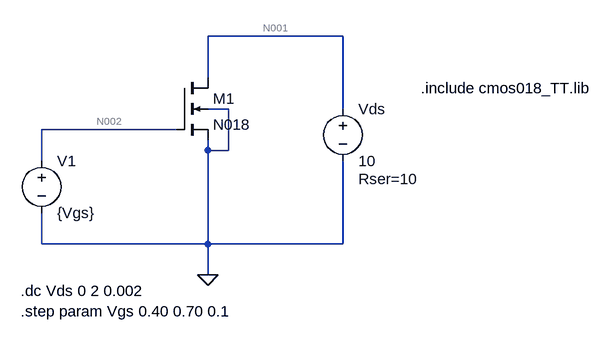
[diagram p0: schematic N018_Char.asc]
N018_Char.asc, the LTspice schematic file:
Version 4
SHEET 1 880 680
WIRE 416 96 208 96
WIRE 208 160 208 96
WIRE 240 208 208 208
WIRE 416 208 416 96
WIRE 160 240 -48 240
WIRE 208 272 208 256
WIRE 240 272 240 208
WIRE 240 272 208 272
WIRE -48 288 -48 240
WIRE -48 416 -48 368
WIRE 208 416 208 272
WIRE 208 416 -48 416
WIRE 416 416 416 288
WIRE 416 416 208 416
WIRE 208 464 208 416
FLAG 208 464 0
SYMBOL voltage -48 272 R0
WINDOW 123 0 0 Left 0
WINDOW 39 0 0 Left 0
SYMATTR InstName V1
SYMATTR Value {Vgs}
SYMBOL voltage 416 192 R0
WINDOW 123 0 0 Left 0
WINDOW 39 24 124 Left 2
SYMATTR SpiceLine Rser=10
SYMATTR InstName Vds
SYMATTR Value 10
SYMBOL nmos4 160 160 R0
SYMATTR InstName M1
SYMATTR Value N018
SYMATTR Value2 l=0.5u w=10u
TEXT 536 176 Left 2 !.include cmos018_TT.lib
TEXT -80 488 Left 2 !.dc Vds 0 2 0.002
TEXT -80 520 Left 2 !.step param Vgs 0.40 0.70 0.1

The netlist it stands for:
* N018_Char.asc
V1 N002 0 {Vgs}
Vds N001 0 10 Rser=10
M1 N001 N002 0 0 N018 l=0.5u w=10u
.model NMOS NMOS
.model PMOS PMOS
.lib standard.mos
.include cmos018_TT.lib
.dc Vds 0 2 0.002
.step param Vgs 0.40 0.70 0.1
.backanno
.end

* Results of the author's LTspice run, read from the files saved beside the schematic
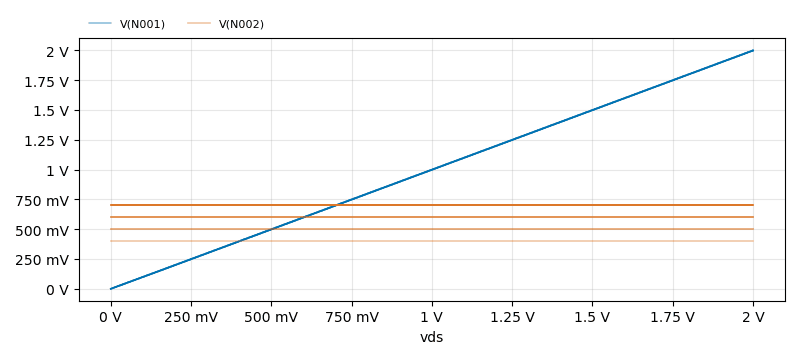
[diagram p1: DC transfer characteristic of N018_Char.asc, plotted from the saved traces]
* DC transfer characteristic, 4 runs:
*   V(N001) [vgs=0.4]: 3.503e-06 fV at vds=0 V, 2 V at vds=2 V, min 3.503e-06 fV, max 2 V
*   V(N001) [vgs=0.5]: -8.186e-05 fV at vds=0 V, 2 V at vds=2 V, min -8.186e-05 fV, max 2 V
*   V(N001) [vgs=0.6]: -0.00829 fV at vds=0 V, 1.999 V at vds=2 V, min -0.00829 fV, max 1.999 V
*   V(N001) [vgs=0.7]: -0.04193 fV at vds=0 V, 1.998 V at vds=2 V, min -0.04193 fV, max 1.998 V
*   V(N002) [vgs=0.4]: 400 mV at vds=0 V, 400 mV at vds=2 V, min 400 mV, max 400 mV
*   V(N002) [vgs=0.5]: 500 mV at vds=0 V, 500 mV at vds=2 V, min 500 mV, max 500 mV
*   V(N002) [vgs=0.6]: 600 mV at vds=0 V, 600 mV at vds=2 V, min 600 mV, max 600 mV
*   V(N002) [vgs=0.7]: 700 mV at vds=0 V, 700 mV at vds=2 V, min 700 mV, max 700 mV